# EAGLE design Power Supply V4.1 (EAGLE 6.5.0)
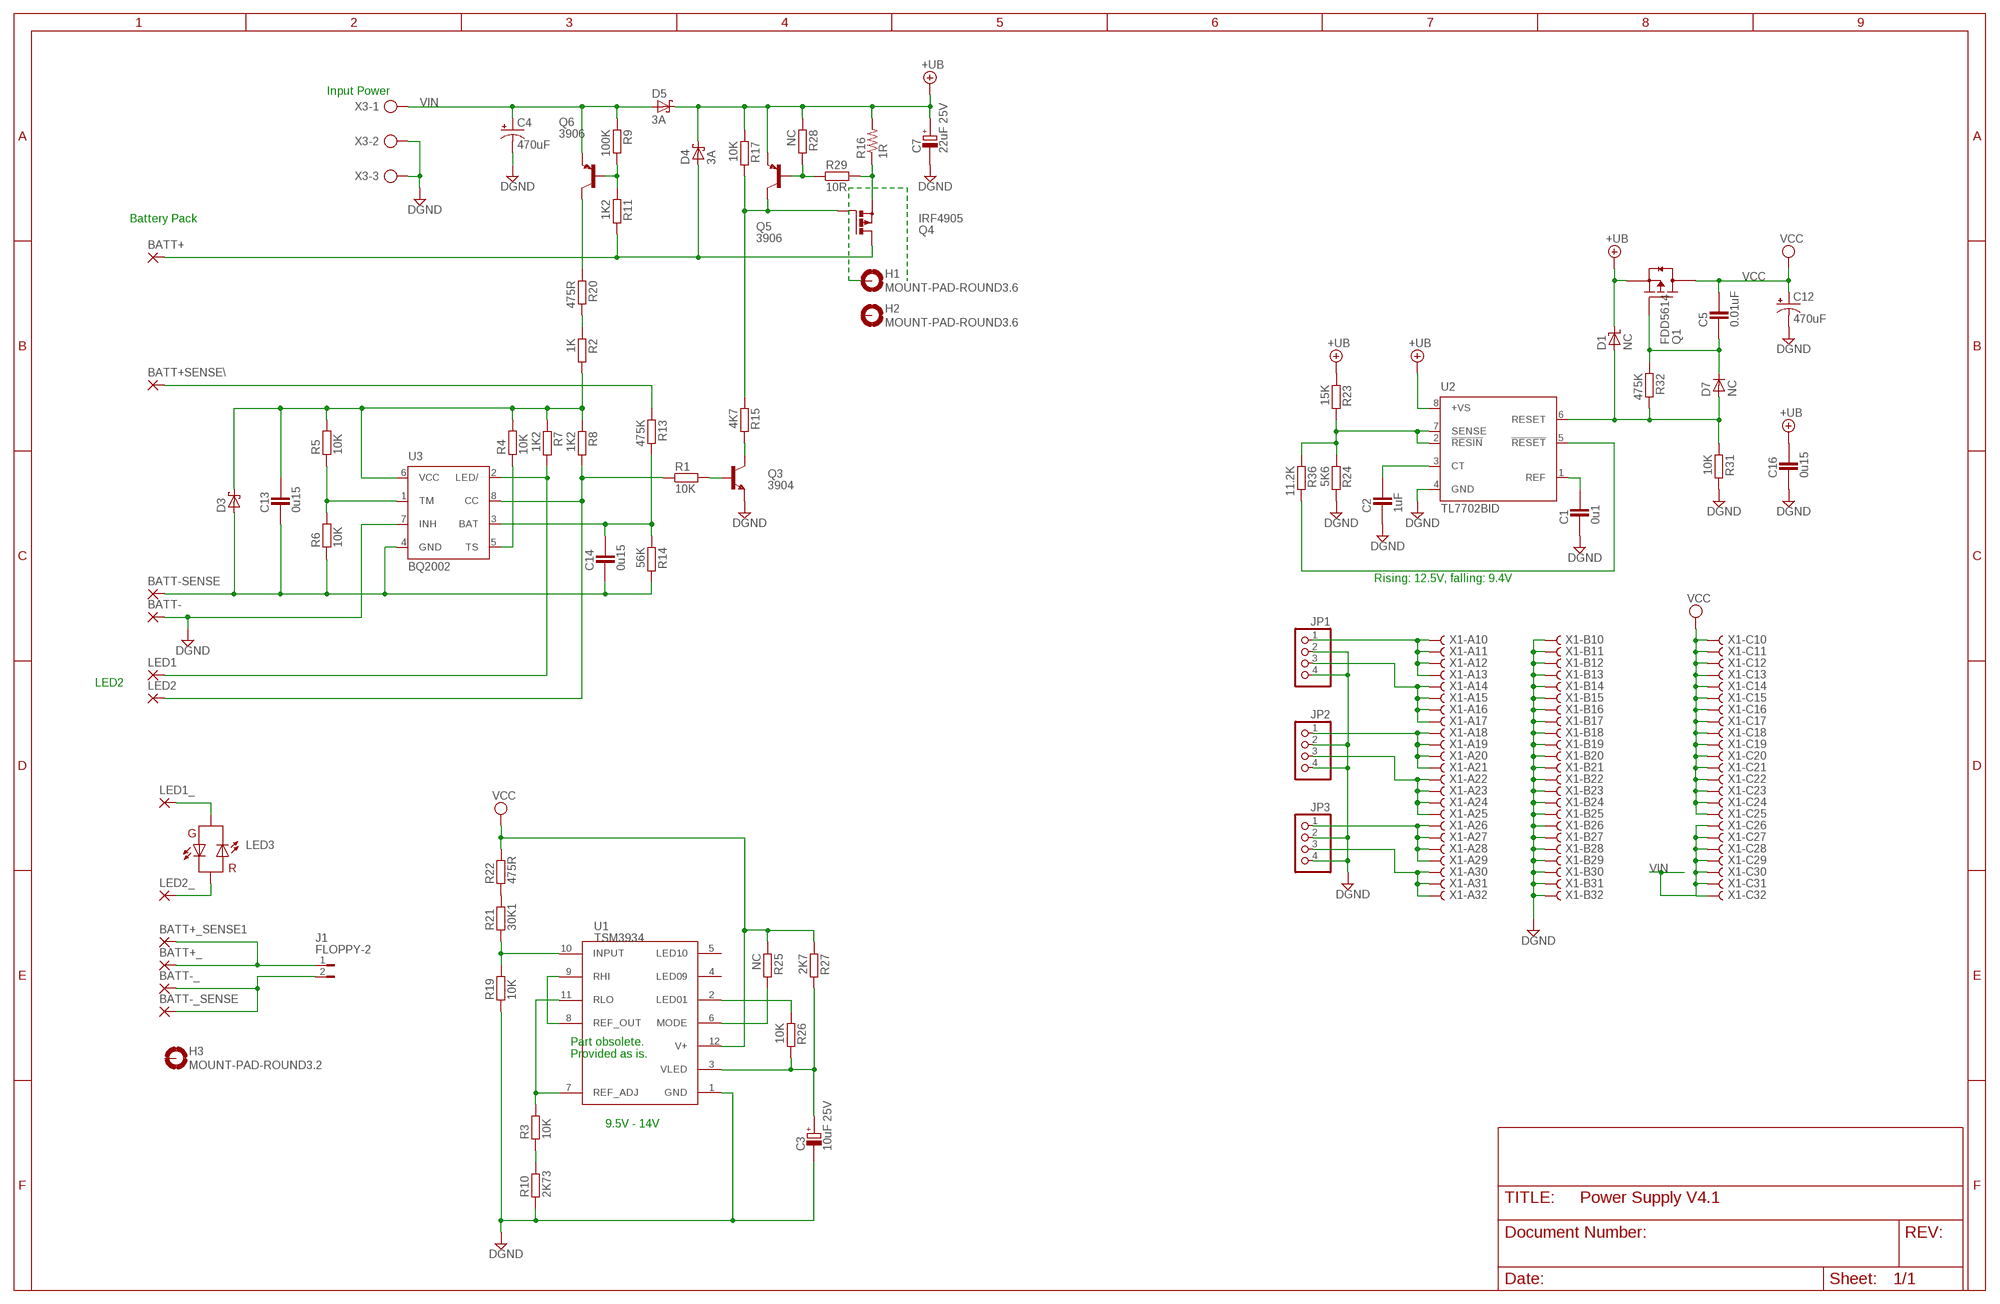
[diagram p0: schematic, sheet 1]

## Parts
BATT+  SMD5  [SMD2,54-5,08]
BATT+_  SMD5  [SMD2,54-5,08]
BATT+_SENSE1  SMD5  [SMD2,54-5,08]
BATT+SENSE\  SMD5  [SMD2,54-5,08]
BATT-  SMD5  [SMD2,54-5,08]
BATT-_  SMD5  [SMD2,54-5,08]
BATT-_SENSE  SMD5  [SMD2,54-5,08]
BATT-SENSE  SMD5  [SMD2,54-5,08]
C1  0u1  CAPACITOR_0603  [CAPC1608X92N]
C2  1uF  CAPACITOR_0603  [CAPC1608X92N]
C3  10uF 25V  POLARISED_D_CASE  [CAPMP7343X310N]
C4  470uF  CAP_POLG  [PANASONIC_G]
C5  0.01uF  CAPACITOR_0805N  [CAP2012X70N]
C7  22uF 25V  POLARISED_D_CASE  [CAPMP7343X310N]
C12  470uF  CAP_POLG  [PANASONIC_G]
C13  0u15  CAPACITOR_0603  [CAPC1608X92N]
C14  0u15  CAPACITOR_0603  [CAPC1608X92N]
C16  0u15  CAPACITOR_0603  [CAPC1608X92N]
D1  NC  ZENER_SOT-23  [SOT95P280X135-3N]
D3  SCHOTTKY_SOT-23  [SOT95P280X135-3N]
D4  3A  SCHOTTKY_SMC  [DIOM7959X265N]
D5  3A  SCHOTTKY_SMC  [DIOM7959X265N]
D7  NC  DIODE_SOT-23  [SOT95P280X135-3N]
H1  MOUNT-PAD-ROUND3.6  [3,6-PAD]
H2  MOUNT-PAD-ROUND3.6  [3,6-PAD]
H3  MOUNT-PAD-ROUND3.2  [3,2-PAD]
J1  FLOPPY-2  [FLOPPY-2]
JP1  PINHD-1X4_2.54  [1X04]
JP2  PINHD-1X4_2.54  [1X04]
JP3  PINHD-1X4_2.54  [1X04]
LED1  SMD5  [SMD2,54-5,08]
LED1_  SMD5  [SMD2,54-5,08]
LED2  SMD5  [SMD2,54-5,08]
LED2_  SMD5  [SMD2,54-5,08]
LED3  DUAL-LED3MM  [LED3MM]
Q1  FDD5614  MOSFET-PCH_D-PAK  [D-PAK_TO252AA]
Q3  3904  NPN_SOT-23  [SOT95P280X135-3N]
Q4  IRF4905  PMOSFET_PTO220BH  [TO220BH]
Q5  3906  PNP_SOT-23  [SOT95P280X135-3N]
Q6  3906  PNP_SOT-23  [SOT95P280X135-3N]
R1  10K  RESISTOR_0603  [RESC1608X55N]
R2  1K  RESISTOR_0805  [RESC2012X70N]
R3  10K  RESISTOR_0603  [RESC1608X55N]
R4  10K  RESISTOR_0603  [RESC1608X55N]
R5  10K  RESISTOR_0603  [RESC1608X55N]
R6  10K  RESISTOR_0603  [RESC1608X55N]
R7  1K2  RESISTOR_0603  [RESC1608X55N]
R8  1K2  RESISTOR_0603  [RESC1608X55N]
R9  100K  RESISTOR_0603  [RESC1608X55N]
R10  2K73  RESISTOR_0603  [RESC1608X55N]
R11  1K2  RESISTOR_0603  [RESC1608X55N]
R13  475K  RESISTOR_0603  [RESC1608X55N]
R14  56K  RESISTOR_0805  [RESC2012X70N]
R15  4K7  RESISTOR_0603  [RESC1608X55N]
R16  1R  R-US_0411/12  [0411/12]
R17  10K  RESISTOR_0603  [RESC1608X55N]
R19  10K  RESISTOR_0603  [RESC1608X55N]
R20  475R  RESISTOR_0805  [RESC2012X70N]
R21  30K1  RESISTOR_0603  [RESC1608X55N]
R22  475R  RESISTOR_0603  [RESC1608X55N]
R23  15K  RESISTOR_0805  [RESC2012X70N]
R24  5K6  RESISTOR_0805  [RESC2012X70N]
R25  NC  RESISTOR_0603  [RESC1608X55N]
R26  10K  RESISTOR_0603  [RESC1608X55N]
R27  2K7  RESISTOR_0603  [RESC1608X55N]
R28  NC  RESISTOR_0603  [RESC1608X55N]
R29  10R  RESISTOR_0603  [RESC1608X55N]
R31  10K  RESISTOR_0603  [RESC1608X55N]
R32  475K  RESISTOR_0603  [RESC1608X55N]
R36  11.2K  RESISTOR_0603  [RESC1608X55N]
U1  TSM3934  [TSM3934]
U2  TL7702BID  TL77002AID  [SO08]
U3  BQ2002  BQ2002TP  [DIL08]
X1  FABC69R  [FABC69R]
X3  AK500/3  [AK500/3]

## Nets
+UB: C7.+ C16.2 D1.3(K) D4.K D5.K Q1.3(S) Q5.2(E) R16.2 R17.1 R23.1 R28.1 U2.8(+VS)
DGND: BATT-.1(P) C1.1 C2.1 C3.- C4.- C7.- C12.- C16.1 JP1.2 JP1.4 JP2.2 JP2.4 JP3.2 JP3.4 Q3.2(E) R10.1 R19.1 R24.2 R31.2 U1.1(GND) U2.4(GND) U3.7(INH) X1.B10 X1.B11 X1.B12 X1.B13 X1.B14 X1.B15 X1.B16 X1.B17 X1.B18 X1.B19 X1.B20 X1.B21 X1.B22 X1.B23 X1.B24 X1.B25 X1.B26 X1.B27 X1.B28 X1.B29 X1.B30 X1.B31 X1.B32 X3.2 X3.3
N$1: R23.2 R24.1 R36.1 U2.2(!RESIN) U2.7(SENSE)
N$2: Q3.1(B) R1.2
N$3: H1.B3,6(MOUNT)
N$5: R2.1 R20.2
N$7: Q6.3(C) R20.1
N$9: C2.2 U2.3(CT)
N$10: C13.2 D3.3(K) R2.2 R4.2 R5.2 R7.1 R8.1 U3.6(VCC)
N$11: C1.2 U2.1(REF)
N$12: R36.2 U2.5(!RESET)
N$13: LED2.1(P) R1.1 R8.2 U3.8(CC)
N$14: C5.1 D7.3(K) Q1.1(G) R32.1
N$15: R4.1 U3.5(TS)
N$16: C14.2 R13.2 R14.1 U3.3(BAT)
N$17: R3.2 U1.7(REF_ADJ) U1.11(RLO)
N$18: Q3.3(C) R15.2
N$19: Q4.G Q5.3(C) R15.1 R17.2
N$20: Q4.S R16.1 R29.2
N$21: BATT+.1(P) D4.A Q4.D R11.2
N$22: D1.1(A) D7.1(A) R31.1 R32.2 U2.6(RESET)
N$23: U1.8(REF_OUT) U1.9(RHI)
N$24: Q6.1(B) R9.2 R11.1
N$25: R21.2 R22.1
N$26: R5.1 R6.2 U3.1(TM)
N$27: LED1.1(P) R7.2 U3.2(LED/)
N$28: R19.2 R21.1 U1.10(INPUT)
N$29: R3.1 R10.2
N$30: BATT+SENSE\.1(P) R13.1
N$31: LED1_.1(P) LED3.A
N$32: C3.+ R26.2 R27.2 U1.3(VLED)
N$33: LED2_.1(P) LED3.K(C)
N$34: R25.2 U1.6(MODE)
N$35: BATT-_.1(P) BATT-_SENSE.1(P) J1.2
N$36: R26.1 U1.2(LED01)
N$38: BATT+_.1(P) BATT+_SENSE1.1(P) J1.1
N$45: Q5.1(B) R28.2 R29.1
N$55: JP1.1 X1.A10 X1.A11 X1.A12 X1.A13
N$56: JP1.3 X1.A14 X1.A15 X1.A16 X1.A17
N$57: JP2.1 X1.A18 X1.A19 X1.A20 X1.A21
N$58: JP2.3 X1.A22 X1.A23 X1.A24 X1.A25
N$59: JP3.1 X1.A26 X1.A27 X1.A28 X1.A29
N$60: JP3.3 X1.A30 X1.A31 X1.A32
N$98: BATT-SENSE.1(P) C13.1 C14.1 D3.1(A) R6.1 R14.2 U3.4(GND)
VCC: C5.2 C12.+ Q1.4(D) R22.2 R25.1 R27.1 U1.12(V+) X1.C10 X1.C11 X1.C12 X1.C13 X1.C14 X1.C15 X1.C16 X1.C17 X1.C18 X1.C19 X1.C20 X1.C21 X1.C22 X1.C23 X1.C24 X1.C25
VIN: C4.+ D5.A Q6.2(E) R9.1 X1.C26 X1.C27 X1.C28 X1.C29 X1.C30 X1.C31 X1.C32 X3.1
Unconnected: H2.B3,6(MOUNT) H3.B3,2(MOUNT) U1.4(LED09) U1.5(LED10)

## Notes on the sheet
- Input Power
- Battery Pack
- Rising: 12.5V, falling: 9.4V
- LED2
- Part obsolete.
  Provided as is.
- 9.5V - 14V

## Library data of the parts
BATT+ BATT+_ BATT+_SENSE1 BATT+SENSE\ BATT- BATT-_ BATT-_SENSE BATT-SENSE LED1 LED1_ LED2 LED2_ = wirepad:SMD5: SMD PAD
C1 C2 C5 C13 C14 C16 = ipc-7351-capacitor:CAPACITOR_
C3 C7 = ipc-7351-capacitor:POLARISED_
C4 C12 = SparkFun:CAP_POL: Capacitor Polarized These are standard SMD and PTH capacitors. Normally 10uF, 47uF, and 100uF in electrolytic and tantalum varieties. Always verify the external diameter of the through hole cap, it varies with capacity, voltage, and manufacturer. The EIA devices should be standard.
D1 = ipc-7351-diode:ZENER_
D3-D5 = ipc-7351-diode:SCHOTTKY_
D7 = ipc-7351-diode:DIODE_
H1-H3 = holes:MOUNT-PAD-ROUND: MOUNTING PAD, round
J1 = Misc Conn:FLOPPY-2
JP1-JP3 = Misc Conn:PINHD-1X4: PIN HEADER
LED3 = Misc opto:DUAL-LED: LEDs Standard schematic elements and footprints for 5mm, 3mm, 1206, and 0603 sized LEDs. 5mm - Spark Fun Electronics SKU : COM-00529 (and others)
Q1 = ipc-7351-transistor:MOSFET-PCH_
Q3 = ipc-7351-transistor:NPN_
Q4 = transistor-power:PMOSFET_P: Power MOSFET P-Channel
Q5 Q6 = ipc-7351-transistor:PNP_
R1-R11 R13-R15 R17 R19-R29 R31 R32 R36 = ipc-7351-resistor:RESISTOR_
R16 = resistor:R-US_: RESISTOR, American symbol
U1 = Misc opto:TSM3934
U2 = linear:TL770*: SUPPLY VOLTAGE SUPERVISORS TL7700A Series Source: http://www.st.com/stonline/products/literature/ds/1528.pdf
U3 = texas:BQ2002TP: CHARGE MANAGEMENT IC
X1 = Misc Conn:FABC69R: CONNECTOR Modified female, 69 pins, type R, rows ABC, grid 2.54 mm
X3 = con-ptr500:AK500/3: CONNECTOR

## Board
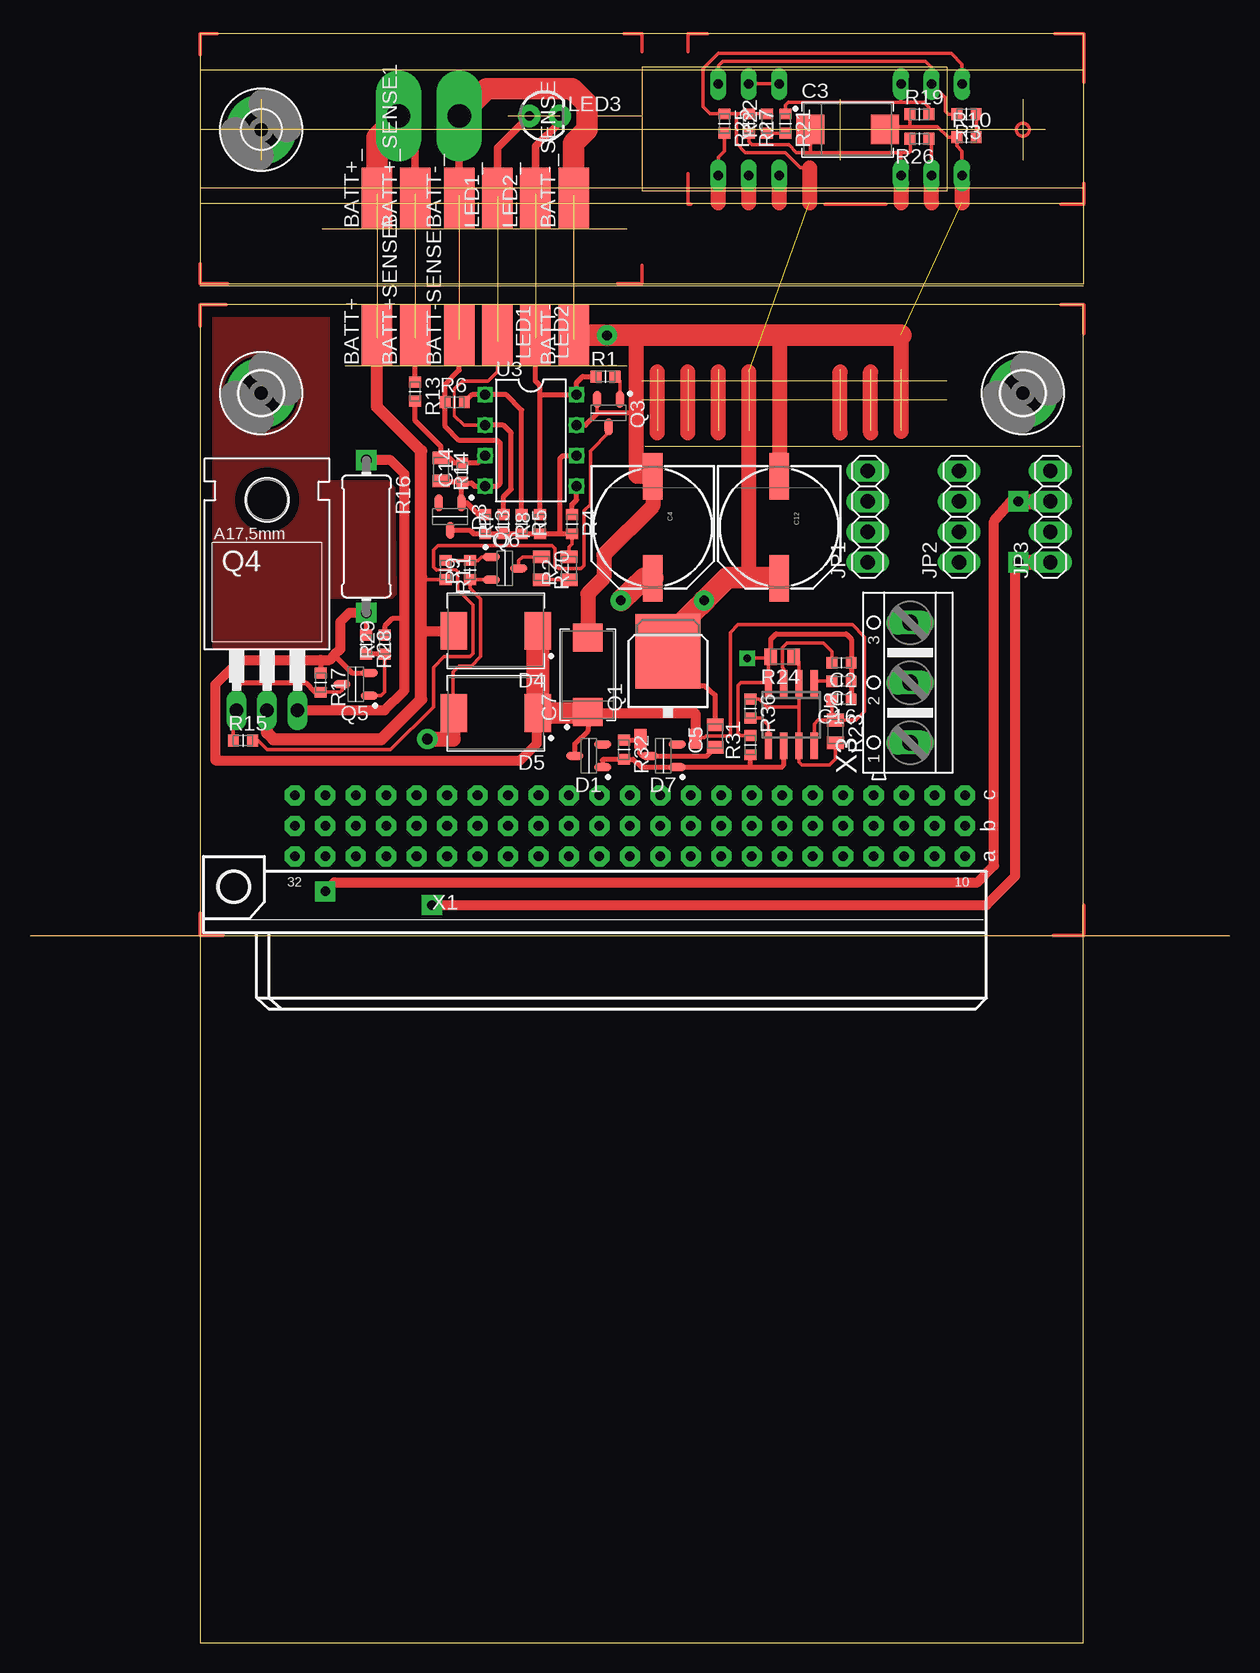
[diagram p1: board, top side]
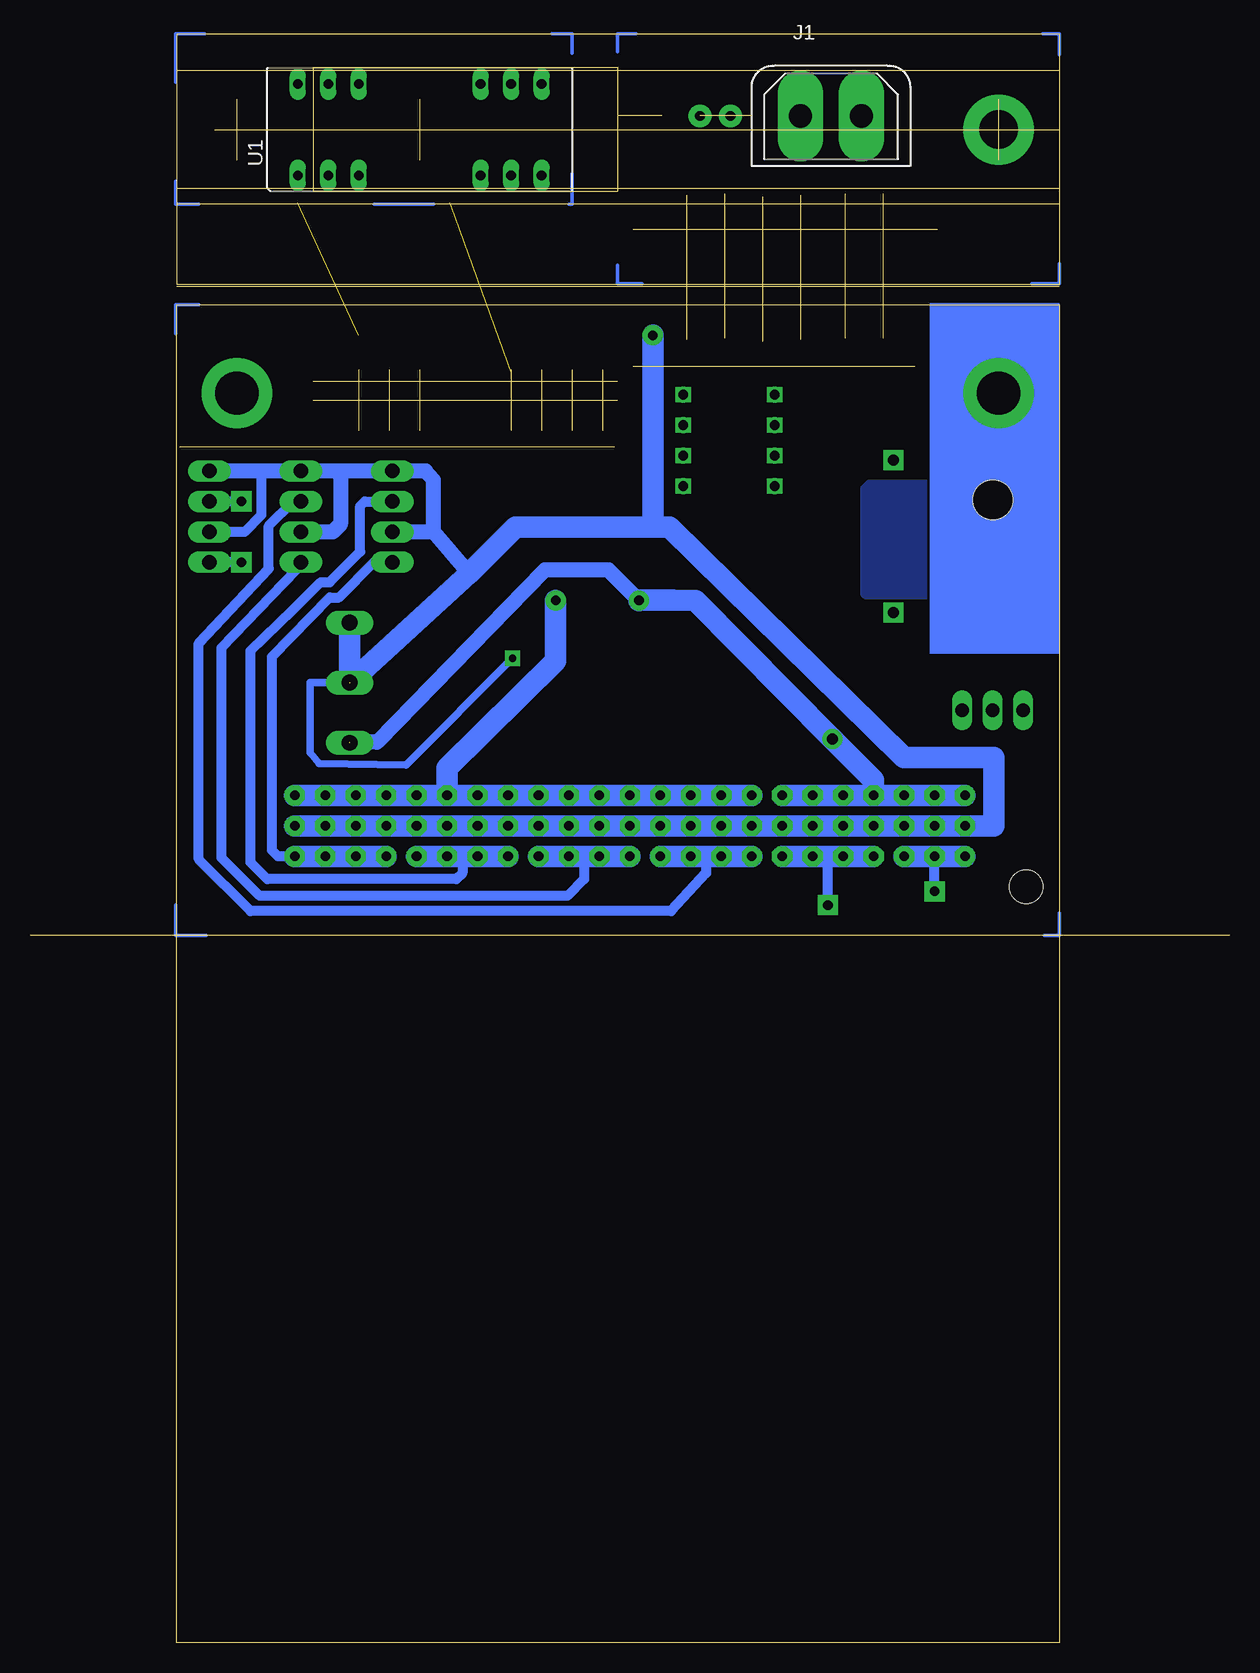
[diagram p2: board, bottom side, seen from below]

Size 100.03 x 134.11 mm. Coordinates in mm from the lower left corner, seen from the top.
Outline: 19.28,128.64 19.28,123.56
Outline: 87.81,131.06 87.81,121.22
Outline: 87.81,121.22 87.81,119.95
Outline: 87.81,119.95 87.81,113.22 14.2,113.22 14.2,119.95
Outline: 14.2,131.06 14.2,134.11 87.81,134.11 87.81,131.06
Outline: 14.2,131.06 14.2,126.11
Outline: 14.2,126.11 14.2,121.22
Outline: 14.2,121.22 14.2,119.95
Outline: 84.63,126.11 14.2,126.11
Outline: 28.93,120.78 28.93,108.71
Outline: 35.79,120.65 35.79,108.59
Outline: 38.96,120.52 38.96,108.46
Outline: 42.14,120.78 42.14,108.71
Outline: 45.31,120.65 45.31,108.59
Outline: 87.81,131.06 14.2,131.06
Outline: 87.81,121.22 14.2,121.22
Outline: 32.11,120.78 32.11,108.71
Outline: 87.81,119.95 14.2,119.95
Outline: 82.78,128.64 82.78,123.56
Outline: 67.54,128.64 67.54,123.56
Outline: 52.3,106.1 52.3,101.02
Outline: 54.84,106.1 54.84,101.02
Outline: 57.38,106.1 57.38,101.02
Outline: 70.08,106.1 70.08,101.02
Outline: 72.62,106.1 72.62,101.02
Outline: 67.54,106.1 67.54,101.02
Outline: 39.87,127.25 44.18,127.25
Outline: 47.36,127.25 51.04,127.25
Outline: 87.81,113.08 14.2,113.08
Outline: 76.43,105.13 51.03,105.13
Outline: 76.43,103.56 51.03,103.56
Outline: 59.92,106.1 59.92,101.02
Outline: 87.55,99.69 51.28,99.69
Outline: 49.76,106.4 26.26,106.4
Outline: 49.76,117.83 24.36,117.83
Outline: 14.2,0 87.81,0 87.81,111.51 14.2,111.51 14.2,0
Outline: 51.03,131.32 51.03,120.97 76.43,120.97 76.43,131.32 51.03,131.32
Copper layers (1*16): Top 0.035mm / dielectric 1.5mm / Bottom 0.035mm
Design rules "default": minimum track width 10mil, minimum drill 24mil, track to track 8mil, track to pad 8mil, pad to pad 8mil, via to via 8mil, smd to smd 8mil, copper to edge 40mil, drill to drill 8mil, minimum pad ring 10mil, minimum via ring 8mil, stop-mask expansion 4mil, vias tented up to drill 0mil, thermal gap 10mil

### Footprints (pad centres in the part's own frame; a part is rotated, then mirrored left to right if it is on the bottom)
SMD2,54-5,08 = smd 2.54 x 5.08: 1 0,0
CAPC1608X92N = smd 0.9 x 0.95: 1 -0.8,0; 2 0.8,0
CAPMP7343X310N = smd 2.35 x 2.45: + -3.1,0; - 3.1,0
PANASONIC_G = smd 3.9 x 1.6: + 4.25,0; - -4.25,0
CAP2012X70N = smd 1.05 x 1.4: 1 -0.95,0; 2 0.95,0
SOT95P280X135-3N = smd 1.4 x 0.65: 1 -1.15,0.95; 2 -1.15,-0.95; 3 1.15,0
DIOM7959X265N = smd 2.2 x 3.15: A 3.5,0; K -3.5,0
3,6-PAD = drill 3.6 pad 5.842: B3,6 0,0
3,2-PAD = drill 3.2 pad 5.842: B3,2 0,0
FLOPPY-2 = drill 1.93 pad 3.81 long: 1 2.54,0; 2 -2.54,0
1X04 = drill 1.2 long: 1 -3.81,0; 2 -1.27,0; 3 1.27,0; 4 3.81,0
LED3MM = drill 0.813 pad 1.88: A -1.27,0; K 1.27,0
D-PAK_TO252AA = smd 1 x 1.6: 1 -2.28,-4.8; 3 2.28,-4.8 | smd 5.4 x 6.2: 4 0,2.5
TO220BH = drill 1.118 long: D 0,-6.35; G -2.54,-6.35; S 2.54,-6.35 | hole 3.302: 0,11.176
RESC1608X55N = smd 0.9 x 1: 1 -0.8,0; 2 0.8,0
RESC2012X70N = smd 1.05 x 1.4: 1 -0.95,0; 2 0.95,0
0411/12 = drill 0.914 octagon: 1 -6.35,0; 2 6.35,0
TSM3934 = drill 0.813 long: 1 -10.16,-3.81; 2 -7.62,-3.81; 3 -5.08,-3.81; 4 5.08,-3.81; 5 7.62,-3.81; 6 10.16,-3.81; 7 10.16,3.81; 8 7.62,3.81; 9 5.08,3.81; 10 -5.08,3.81; 11 -7.62,3.81; 12 -10.16,3.81
SO08 = smd 0.6 x 2.2: 1 -1.905,-2.6; 2 -0.635,-2.6; 3 0.635,-2.6; 4 1.905,-2.6; 5 1.905,2.6; 6 0.635,2.6; 7 -0.635,2.6; 8 -1.905,2.6
DIL08 = drill 0.813 pad 1.27: 1 -3.81,-3.81; 2 -1.27,-3.81; 3 1.27,-3.81; 4 3.81,-3.81; 5 3.81,3.81; 6 1.27,3.81; 7 -1.27,3.81; 8 -3.81,3.81
FABC69R = drill 0.8 pad 1.676 octagon: A10 -3.81,27.94; A11 -3.81,25.4; A12 -3.81,22.86; A13 -3.81,20.32; A14 -3.81,17.78; A15 -3.81,15.24; A16 -3.81,12.7; A17 -3.81,10.16; A18 -3.81,7.62; A19 -3.81,5.08; A20 -3.81,2.54; A21 -3.81,0; A22 -3.81,-2.54; A23 -3.81,-5.08; A24 -3.81,-7.62; A25 -3.81,-10.16; A26 -3.81,-12.7; A27 -3.81,-15.24; A28 -3.81,-17.78; A29 -3.81,-20.32; A30 -3.81,-22.86; A31 -3.81,-25.4; A32 -3.81,-27.94; B10 -6.35,27.94; B11 -6.35,25.4; B12 -6.35,22.86; B13 -6.35,20.32; B14 -6.35,17.78; B15 -6.35,15.24; B16 -6.35,12.7; B17 -6.35,10.16; B18 -6.35,7.62; B19 -6.35,5.08; B20 -6.35,2.54; B21 -6.35,0; B22 -6.35,-2.54; B23 -6.35,-5.08; B24 -6.35,-7.62; B25 -6.35,-10.16; B26 -6.35,-12.7; B27 -6.35,-15.24; B28 -6.35,-17.78; B29 -6.35,-20.32; B30 -6.35,-22.86; B31 -6.35,-25.4; B32 -6.35,-27.94; C10 -8.89,27.94; C11 -8.89,25.4; C12 -8.89,22.86; C13 -8.89,20.32; C14 -8.89,17.78; C15 -8.89,15.24; C16 -8.89,12.7; C17 -8.89,10.16; C18 -8.89,7.62; C19 -8.89,5.08; C20 -8.89,2.54; C21 -8.89,0; C22 -8.89,-2.54; C23 -8.89,-5.08; C24 -8.89,-7.62; C25 -8.89,-10.16; C26 -8.89,-12.7; C27 -8.89,-15.24; C28 -8.89,-17.78; C29 -8.89,-20.32; C30 -8.89,-22.86; C31 -8.89,-25.4; C32 -8.89,-27.94 | hole 2.794: -1.27,-33.026
AK500/3 = drill 1.321 long: 1 -5.004,0; 2 0,0; 3 5.004,0

### Placement (x,y rotation side)
BATT+  28.93,108.97 0 top
BATT+_  28.93,120.4 0 top
BATT+_SENSE1  32.11,120.4 0 top
BATT+SENSE\  32.11,108.97 0 top
BATT-  45.31,108.97 0 top
BATT-_  35.79,120.4 0 top
BATT-_SENSE  45.31,120.4 0 top
BATT-SENSE  35.79,108.97 0 top
C1  67.67,80.14 180 top
C2  67.67,81.66 180 top
C3  68.17,126.11 0 top
C4  51.92,92.96 270 top
C5  57.12,75.56 90 top
C7  46.51,80.67 90 top
C12  62.46,92.96 270 top
C13  37.95,93.22 270 top
C14  36.04,97.54 90 top
C16  67.67,78.61 180 top
D1  46.58,73.91 180 top
D3  35.03,93.85 270 top
D4  38.84,84.33 180 top
D5  38.84,77.47 180 top
D7  52.81,73.91 180 top
H1  19.28,104.14 0 top
H2  82.78,104.14 0 top
H3  19.28,126.11 0 top
J1  33.25,127.25 0 bottom
JP1  69.82,93.85 90 top
JP2  77.44,93.85 90 top
JP3  85.06,93.85 90 top
LED1  38.96,108.97 180 top
LED1_  38.96,120.4 0 top
LED2  42.14,108.97 180 top
LED2_  42.14,120.4 0 top
LED3  42.9,127.25 0 top
Q1  53.19,80.14 0 top
Q3  48.23,102.49 270 top
Q4  19.76,84.07 0 top
Q5  27.15,79.88 180 top
Q6  39.6,89.53 0 top
R1  47.98,105.54 0 top
R2  44.93,89.53 90 top
R3  78.08,127.38 180 top
R4  45.19,93.22 270 top
R5  41,93.22 270 top
R6  35.41,103.38 0 top
R7  39.47,93.22 90 top
R8  42.52,93.22 90 top
R9  36.68,89.41 90 top
R10  78.08,125.48 0 top
R11  34.65,89.41 270 top
R13  32.11,104.27 270 top
R14  34.26,97.79 270 top
R15  17.75,75.18 0 top
R16  28.04,92.2 270 top
R17  24.23,80.01 270 top
R19  74.14,127.38 0 top
R20  42.65,89.53 270 top
R21  62.97,126.62 270 top
R22  61.44,126.62 90 top
R23  67.16,75.95 270 top
R24  62.71,82.17 180 top
R25  57.89,126.62 270 top
R26  74.14,125.35 180 top
R27  59.92,126.62 270 top
R28  28.04,83.19 270 top
R29  29.57,83.19 90 top
R31  60.05,74.8 90 top
R32  49.5,74.42 270 top
R36  60.05,77.85 270 top
U1  67.54,126.11 0 bottom
U2  63.47,77.34 180 top
U3  41.76,100.2 270 top
X1  50.01,61.72 270 top
X3  73.38,80.01 90 top

### Tracks (layer width: path | path; a pad name or v marks a point on that pad's centre or on a via)
+UB
  Top 0.305: R23.1 65.69,76.9 65.38,76.58 U2.8 | C16.2 66.87,77.06 R23.1 | R23.1 68.87,76.9 69.57,77.6 69.57,83.82 68.55,84.84 59.03,84.84 58.39,84.2 58.39,75.69 58.27,75.56 56.36,75.56 56.24,75.44 55.47,75.44 | 55.47,77.47 55.47,77.72 | Q1.3
  Top 0.406: 24.23,81.91 R17.1 | Q5.2 26.84,80.83 25.37,82.3 | R16.2 R28.1 | 46.58,77.49 C7.+ 46.51,76 45.43,74.92 D1.3
  Top 0.813: R16.2 26.64,85.85 25.88,85.09 25.88,82.8 25.37,82.3 24.99,81.91 24.23,81.91 17.5,81.91 15.47,79.88 15.47,73.53 40.87,73.53 42.27,74.93 42.27,77.4 D5.K | D4.K 42.36,84.36 | 46.58,77.47 55.47,77.47 55.47,75.44 Q1.3
  Top 1.27: C7.+ 46.53,77.52 46.58,77.47
  Top 1.778: D5.K 46.58,77.47
  Top 1.93: D5.K D4.K
DGND  (via drill 0.6 pad 1.27, 0.8 pad 1.68)  (2 unrouted)
  Top 0.305: C3.- 70.97,126.11 | C3.- 71.09,126.11 71.35,126.37 | 73.38,126.37 75.67,126.37 76.56,125.48 R10.1 77.28,124.75 77.7,124.33 U1.1 | R19.1 73.34,126.4 73.38,126.37 | R31.2 59.25,75.6 59.03,75.82 59.03,79.76 59.28,80.01 61.5,80.01 U2.4 61.57,81.98 R24.2 61.64,82.04 v59.79,82.04 | Q3.2 47.28,102.55 47.35,102.49 | 73.38,126.37 71.53,126.37 C3.-
  Top 0.406: 45.57,101.48 U3.7 46.33,101.47 47.35,102.49 | C16.1 C1.1 C2.1 68.47,83.66 68.05,84.07 62.2,84.07 61.76,83.63 R24.2 | 47.35,102.49 | 50.52,102.49 47.35,102.49
  Top 1.27: U1.1 77.7,120.02 | 72.62,108.97 72.62,100.97 | 50.52,108.97 50.52,102.49 50.52,97.28 50.59,97.21 C4.- 51.92,94.74 47.85,90.68 47.85,88.77 46.51,87.43 C7.- | 62.46,108.97 C12.-
  Top 1.778: 72.62,108.97 62.46,108.97 50.52,108.97 v48.11,108.97 BATT-.1
  Bottom 0.61: v59.79,82.04 68.68,73.15 75.92,73.28 76.68,74.17 76.68,80.01 X3.2
  Bottom 0.813: 74.27,97.66 74.4,97.54 | JP3.2 82.14,92.58 80.75,93.98 80.75,97.66
  Bottom 1.27: JP3.4 80.75,97.66 JP2.4 74.27,97.66 JP1.4 67.03,97.66 66.4,96.9 66.4,92.58 | 63.41,89.09 66.4,92.58 | 66.4,92.58 JP1.2 | JP2.2 74.78,92.58 74.14,93.22 74.14,97.28 74.4,97.54
  Bottom 1.778: X1.B10 X1.B11 X1.B12 X1.B13 X1.B14 X1.B15 X1.B16 X1.B17 X1.B18 X1.B19 X1.B20 X1.B21 X1.B22 X1.B23 X1.B24 X1.B25 X1.B26 X1.B27 X1.B28 X1.B29 X1.B30 X1.B31 X1.B32 19.66,68.07 19.66,73.79 27.15,73.79 46.71,92.96 48.11,92.96 | 48.11,92.96 v48.11,108.97 | 48.11,92.96 59.54,92.96 63.41,89.09 73.35,80.04 | X3.2 X3.3
N$1
  Top 0.305: 64.11,77.98 U2.2 64.11,81.72 R24.1 | 64.11,77.98 U2.7 64.11,73.41 64.36,73.15 66.65,73.15 67.16,73.66 R23.2 | R36.1 60.77,78.65 61.44,77.98 64.11,77.98
N$2
  Top 0.305: Q3.1 49.18,105.13 R1.2
N$4  (via drill 0.6 pad 1.27)
  other vias: 37.95,104.01
N$5
  Top 0.305: R20.2 R2.1
N$6  (via drill 0.6 pad 1.27)
  other vias: 37.95,101.47
N$7
  Top 0.305: Q6.3 40.75,90.18 41.06,90.48 R20.1
N$8
  Bottom 0.305: 14.2,60.83 14.2,58.93 15.47,58.93
N$9
  Top 0.305: U2.3 62.84,81.15 62.71,81.28 62.71,82.93 63.09,83.31 66.14,83.31 66.87,82.59 C2.2
N$10
  Top 0.305: R5.2 40.93,92.35 | R2.2 44.93,91.31 45.19,91.57 R4.2
  Top 0.406: 44.3,92.42 R8.1 R5.2 R7.1 C13.2 36.97,92.42 36.68,92.71 D3.3 | 44.3,92.42 R4.2 45.12,92.35 | U3.6 44.42,98.93 44.17,98.68 44.17,92.55 44.3,92.42
N$11
  Top 0.305: C1.2 65.38,80.14 U2.1
N$12
  Top 0.305: R36.2 60.97,77.05 61.57,76.45 U2.5
N$13
  Top 0.406: 42.52,104.01 42.52,104.78 42.14,105.16 LED2.1 | 42.52,104.01 U3.8 45.57,105.03 46.08,105.54 R1.1 | R8.2 42.52,104.01
N$14
  Top 0.406: 49.35,75.06 R32.1 50.79,75.22 | 50.79,75.22 Q1.1 | 50.79,75.22 50.79,74.15 51.03,73.91 D7.3 56.42,73.91 C5.1
N$15
  Top 0.406: U3.5 45.57,95.25 45.19,94.87 R4.1
N$16
  Top 0.406: U3.3 37.35,98.34 C14.2 35.37,98.34 34.97,98.74 R14.1 34.26,99.69 32.11,101.85 R13.2
N$17
  Top 0.305: U1.7 57.38,131.44 57.76,131.83 74.65,131.83 75.16,131.32 U1.11 76.3,128.78 76.3,127.63 76.56,127.38 R3.2 77.32,127.29
N$18
  Top 0.254: 35.53,89.41 33.88,89.41
  Top 0.305: R15.2 19.06,75.15 19.79,74.42 30.07,74.42 33.63,77.98 33.63,81.28 34.52,82.17 36.68,82.17 36.93,82.42 36.93,86.49 35.66,87.76 35.66,89.28 35.53,89.41 | 33.88,89.41 33.63,89.66 33.63,91.06 34.01,91.44 43.54,91.44 43.79,91.19 43.79,89.79 44.04,89.53 45.95,89.53 46.2,89.79 46.2,94.36 46.71,94.87 46.71,99.31 48.23,100.84 Q3.3
N$19
  Top 0.305: R17.2 25.84,79.21 26.01,79.38 Q5.3 | 17.25,77.7 Q4.G 16.95,77.46 R15.1
  Top 0.406: Q4.G 17.22,79.6 17.63,80.01 22.96,80.01 23.72,79.25 24.19,79.25 R17.2
N$20
  Top 0.406: R29.2 29.57,84.71 30.2,85.34 31.22,85.34
  Top 0.813: R16.1 30.07,98.55 31.22,97.41 31.22,85.34 31.22,79.38 29.57,77.72 Q4.S
N$21
  Top 0.305: R11.2 32.91,88.61 32.61,88.77
  Top 0.813: 32.61,84.33 D4.A
  Top 1.016: Q4.D 19.76,75.84 20.29,75.31 29.31,75.31 32.61,78.61 32.61,84.33 32.61,88.77 32.61,99.31 28.93,103 BATT+.1
N$22
  Top 0.305: R31.1 60.01,74.04
  Top 0.406: 60.05,72.96 D7.1 50.96,72.96 50.3,73.62 R32.2 47.82,73.62 47.73,73.53 D1.1 | 60.05,72.96 62.65,72.96 62.84,73.15 U2.6 | 60.05,72.96 R31.1
N$23
  Top 0.305: U1.8 U1.9
N$24
  Top 0.305: R11.1 R9.2 37.35,90.21 37.63,90.48 Q6.1
N$25
  Top 0.305: R22.1 R21.2
N$26
  Top 0.406: R5.1 41,102.74 39.73,104.01 U3.1 36.84,104.01 R6.2
N$27
  Top 0.254: 35.41,102.24 35.41,104.52
  Top 0.305: U3.2 36.17,101.47 35.41,102.24 | 35.41,104.52 36.04,105.16 38.2,105.16 38.96,105.92 LED1.1
  Top 0.406: U3.2 39.47,101.47 40.11,100.84 40.11,96.14 39.47,95.5 R7.2
N$28
  Top 0.305: R21.1 62.97,128.14 63.22,128.4 72.62,128.4 | R19.2 74.94,127.98 74.52,128.4 72.62,128.4 | 72.62,128.4 U1.10
N$29
  Top 0.305: R10.2 R3.1
N$30
  Top 0.406: R13.1 BATT+SENSE\.1
N$31
  Top 0.61: LED1_.1 38.96,124.59 LED3.A
N$32
  Top 0.305: R27.2 59.92,125.09 60.17,124.84 63.26,124.84 63.89,124.21 65,124.21 | 72.62,124.21 U1.3 | 65,124.21 72.62,124.21 | C3.+ 65.07,124.28 65,124.21 | 72.62,124.21 73.25,124.21 73.38,124.33 73.38,125.44 R26.2
  Top 1.27: U1.3 72.62,120.02
N$33
  Top 0.61: LED3.K 44.17,126.75 42.14,124.71 LED2_.1
N$34
  Top 0.305: U1.6 57.38,123.82 57.89,124.33 R25.2
  Top 1.27: 57.38,120.02 U1.6
N$35
  Top 0.61: BATT-_.1 J1.2
  Top 1.778: BATT-_SENSE.1 45.31,124.97 46.46,126.11 46.46,128.27 45.19,129.54 38.07,129.54 J1.2
N$36
  Top 0.305: R26.1 75.16,125.48 U1.2
  Top 1.27: 75.16,120.02 U1.2
N$37
  Top 1.27: 59.92,120.02 59.92,122.43
N$38
  Top 0.61: J1.1 32.11,125.86 BATT+_SENSE1.1
  Top 1.778: BATT+_.1 28.93,125.48 J1.1
N$39
  Top 1.27: 62.46,120.02 62.46,122.43
N$40
  Top 1.27: 57.38,100.84 57.38,105.92
N$41
  Top 1.27: 54.84,100.84 54.84,105.92
N$42
  Top 1.27: 52.3,100.84 52.3,105.92
N$43
  Top 1.27: 67.54,100.84 67.54,105.92
N$44
  Top 1.27: 70.08,100.84 70.08,105.92
N$45
  Top 0.305: Q5.1 29.25,78.93 29.57,79.25 R29.1
  Top 0.406: R29.1 R28.2
N$46  (via drill 0.6 pad 1.27)
  other vias: 37.95,98.93
N$47  (via drill 0.6 pad 1.27)
  other vias: 37.95,96.39
N$48  (via drill 0.6 pad 1.27)
  other vias: 45.57,104.01
N$49  (via drill 0.6 pad 1.27)
  other vias: 45.57,101.47
N$50  (via drill 0.6 pad 1.27)
  other vias: 45.57,98.93
N$51  (via drill 0.6 pad 1.27)
  other vias: 45.57,96.39
N$52
  pour Top (no thermals): 14.2,111.51 24.87,111.51 24.87,96.9 24.99,96.77 29.82,96.77 30.33,96.27 30.45,87.38 30.2,87.12 24.74,87.12 24.74,83.06 24.49,82.8 14.2,82.8
N$53
  pour Bottom (no thermals): 24.87,111.51 24.87,96.77 30.2,96.77 30.71,96.27 30.71,87.38 30.45,87.12 24.99,87.12 24.87,87 24.87,83.06 24.61,82.8 14.2,82.8
N$54
  Bottom 0.305: 85.32,58.93 87.86,58.93 87.86,61.47
N$55
  Bottom 0.813: X1.A10 79.35,65.53 79.86,66.04 79.86,82.17 75.03,87.12 74.27,87.12 71.35,90.04 JP1.1
  Bottom 1.778: X1.A13 X1.A12 X1.A11 X1.A10
N$56
  Bottom 0.61: 63.73,65.53 63.98,65.28
  Bottom 0.813: JP1.3 72.11,95.12 72.49,94.74 72.49,90.93 75.03,88.39 75.79,88.39 78.08,86.11 81.64,82.68 81.64,65.02 80.24,63.63 64.49,63.63 63.98,64.14 63.98,65.28
  Bottom 1.778: X1.A14 X1.A15 63.73,65.53 X1.A16 X1.A17
N$57
  Bottom 0.61: 53.95,65.53 53.82,65.41
  Bottom 0.813: JP2.1 77.44,89.79 77.83,89.41 84.05,82.93 84.05,65.41 80.87,62.23 55.22,62.23 53.82,63.63 53.82,65.41
  Bottom 1.778: X1.A18 X1.A19 53.95,65.53 X1.A20 X1.A21
N$58
  Bottom 0.813: JP2.3 78.08,95.12 80.11,93.09 80.11,89.53 85.95,83.31 85.95,65.28 81.64,60.96 46.58,60.96 43.66,64.14 43.66,65.53
  Bottom 1.778: X1.A22 X1.A23 43.66,65.53 X1.A24 X1.A25
N$59  (via drill 0.8 pad 1.68)
  Top 0.813: v82.4,90.04 82.14,89.66 82.14,63.88 79.73,61.47 v33.5,61.47
  Top 1.27: v82.4,90.04 JP3.1
  Bottom 0.813: v82.4,90.04 JP3.1 | v33.5,61.47 33.5,65.28 33.25,65.53
  Bottom 1.778: X1.A26 X1.A27 33.25,65.53 X1.A28 X1.A29
N$60  (via drill 0.8 pad 1.68)
  Top 0.813: v82.4,95.12 81.76,95.12 80.37,93.47 80.37,64.77 78.97,63.37 25.37,63.37 v24.61,62.61
  Top 1.27: v82.4,95.12 JP3.3
  Bottom 0.813: v82.4,95.12 JP3.3 | v24.61,62.61 X1.A31
  Bottom 1.778: X1.A30 X1.A31 X1.A32
N$61
  Top 0.305: 87.86,61.47 87.86,58.93 85.32,58.93
N$62
  Top 0.305: 16.1,58.93 14.2,58.93 14.2,60.83
N$63
  Top 0.305: 87.86,109.09 87.86,111.51 85.95,111.51
N$64
  Top 0.305: 16.36,111.51 14.2,111.51 14.2,109.73
N$65
  Bottom 0.305: 85.95,111.51 87.86,111.51 87.86,109.09
N$66
  Bottom 0.305: 16.48,113.28 14.2,113.28 14.2,114.94
N$67
  Top 0.305: 14.2,114.94 14.2,113.28 16.48,113.28
N$68
  Top 0.305: 14.2,132.33 14.2,134.11 15.6,134.11
N$69
  Bottom 0.305: 14.2,132.33 14.2,134.11 15.6,134.11
N$70
  Bottom 0.305: 49,113.28 51.03,113.28 51.03,114.81
N$71
  Top 0.305: 49,113.28 51.03,113.28 51.03,114.81
N$72
  Top 0.305: 51.03,132.59 51.03,134.11 49.5,134.11
N$73
  Bottom 0.305: 49.5,134.11 51.03,134.11 51.03,132.59
N$74
  Bottom 0.305: 85.95,119.89 87.86,119.89 87.86,121.79
N$75
  Bottom 0.305: 87.86,130.05 87.86,134.11 85.45,134.11
N$76
  Top 0.305: 85.45,134.11 87.86,134.11 87.86,130.05
N$77
  Top 0.305: 87.86,121.67 87.86,119.89 85.95,119.89
N$78
  Top 0.305: 66.27,119.89 71.35,119.89
N$79
  Bottom 0.305: 66.4,119.89 71.35,119.89
N$80
  Bottom 0.305: 54.84,132.46 54.84,134.11 56.49,134.11
N$81
  Top 0.305: 54.84,132.59 54.84,134.11 56.49,134.11
N$82
  Top 0.305: 54.84,122.43 54.84,119.89 55.09,119.89
N$83
  Bottom 0.305: 54.84,122.43 54.84,119.89 55.09,119.89
N$84  (via drill 0.6 pad 1.27)
  other vias: 69.82,97.66
N$85  (via drill 0.6 pad 1.27)
  other vias: 69.82,95.12
N$86  (via drill 0.6 pad 1.27)
  other vias: 69.82,92.58
N$87  (via drill 0.6 pad 1.27)
  other vias: 69.82,90.04
N$88  (via drill 0.6 pad 1.27)
  other vias: 77.44,97.66
N$89  (via drill 0.6 pad 1.27)
  other vias: 77.44,95.12
N$90  (via drill 0.6 pad 1.27)
  other vias: 77.44,92.58
N$91  (via drill 0.6 pad 1.27)
  other vias: 77.44,90.04
N$92  (via drill 0.6 pad 1.27)
  other vias: 85.06,97.66
N$93  (via drill 0.6 pad 1.27)
  other vias: 85.06,95.12
N$94  (via drill 0.6 pad 1.27)
  other vias: 85.06,92.58
N$95  (via drill 0.6 pad 1.27)
  other vias: 85.06,90.04
N$96  (via drill 0.6 pad 1.68)
  other vias: 28.04,85.85
N$97  (via drill 0.6 pad 1.68)
  other vias: 28.04,98.55
N$98
  Top 0.406: C14.1 36.13,96.65 36.8,96.65 37.06,96.39 U3.4 38.96,96.39 39.22,96.65 39.22,99.95 38.96,100.2 35.79,100.2 34.61,101.38 R6.1 34.61,104.86 35.79,106.05 BATT-SENSE.1 | C14.1 34.37,96.74 R14.2 | C14.1 35.98,96.67 D3.1 36.42,95 37.4,94.02 C13.1
VCC  (via drill 0.8 pad 1.68)  (1 unrouted)
  Top 0.305: 58.91,127.42 R25.1 56.71,127.42 56.11,128.02 56.11,131.19 57.38,132.46 76.81,132.46 77.7,131.57 U1.12 | 58.91,127.42 R27.1 R22.2 | 58.91,127.42 58.91,124.96 59.66,124.21 62.97,124.21 64.24,122.94 65,122.94
  Top 0.406: 53.35,82.8 Q1.4 53.19,80.39 53.82,79.76 56.24,79.76 57.12,78.99 C5.2
  Top 1.27: 65,122.94 65,120.02 | 53.19,83.69 Q1.4 53.19,83.82 | 55.18,85.81 55.22,85.85 | 56.36,86.96 56.36,87 | 59.92,88.77 59.92,105.92 | 62.4,88.77 C12.+
  Top 1.778: 53.19,83.82 55.18,85.81 56.36,86.96 v56.2,86.87 | 56.36,87 58.14,88.77 59.92,88.77 62.4,88.77
  Bottom 1.778: X1.C10 X1.C11 X1.C12 X1.C13 X1.C14 X1.C15 | X1.C15 X1.C16 X1.C17 X1.C18 X1.C19 X1.C20 X1.C21 X1.C22 X1.C23 X1.C24 X1.C25 | v56.2,86.87 56.2,81.83 65.25,72.9 X1.C15
VIN  (via drill 0.8 pad 1.68, 0.9 pad 1.68)  (1 unrouted)
  Top 0.305: Q6.2 36.7,88.59 R9.1 36.68,87.88 37.57,87 37.57,82.17 36.8,81.41 35.79,81.41 35.28,80.9 35.28,77.53 D5.A
  Top 1.27: v33.12,75.31 35.28,75.31 35.28,77.41 D5.A
  Top 1.778: C4.+ 51.21,88.71 v49.25,86.87
  Bottom 1.27: v49.25,86.87 51.79,89.41 57.12,89.41 71.09,75.06 73.42,75.06
  Bottom 1.778: X1.C32 X1.C31 X1.C30 X1.C29 | X1.C29 X1.C28 X1.C27 X1.C26 | X1.C29 29.69,71.88 v33.12,75.31 44.55,86.87 46.44,86.89 49.23,86.89 v49.25,86.87
(copper drawn outside any net)
  shapes: Bottom area x2, Bottom circle x3, Top circle x7